# EAGLE design Multiplier (EAGLE 7.2.0)
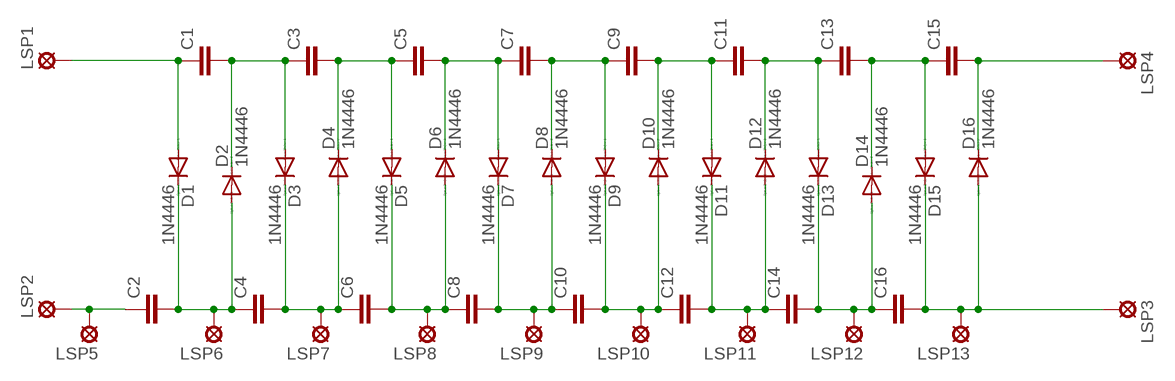
[diagram p0: schematic, sheet 1]

## Parts
C1  C5/4.5  [C5B4.5]
C2  C5/4.5  [C5B4.5]
C3  C5/4.5  [C5B4.5]
C4  C5/4.5  [C5B4.5]
C5  C5/4.5  [C5B4.5]
C6  C5/4.5  [C5B4.5]
C7  C5/4.5  [C5B4.5]
C8  C5/4.5  [C5B4.5]
C9  C5/4.5  [C5B4.5]
C10  C5/4.5  [C5B4.5]
C11  C5/4.5  [C5B4.5]
C12  C5/4.5  [C5B4.5]
C13  C5/4.5  [C5B4.5]
C14  C5/4.5  [C5B4.5]
C15  C5/4.5  [C5B4.5]
C16  C5/4.5  [C5B4.5]
D1  1N4446  [DO35-10]
D2  1N4446  [DO35-10]
D3  1N4446  [DO35-10]
D4  1N4446  [DO35-10]
D5  1N4446  [DO35-10]
D6  1N4446  [DO35-10]
D7  1N4446  [DO35-10]
D8  1N4446  [DO35-10]
D9  1N4446  [DO35-10]
D10  1N4446  [DO35-10]
D11  1N4446  [DO35-10]
D12  1N4446  [DO35-10]
D13  1N4446  [DO35-10]
D14  1N4446  [DO35-10]
D15  1N4446  [DO35-10]
D16  1N4446  [DO35-10]
LSP1  LSP10  [LSP10]
LSP2  LSP10  [LSP10]
LSP3  LSP10  [LSP10]
LSP4  LSP10  [LSP10]
LSP5  LSP10  [LSP10]
LSP6  LSP10  [LSP10]
LSP7  LSP10  [LSP10]
LSP8  LSP10  [LSP10]
LSP9  LSP10  [LSP10]
LSP10  LSP10  [LSP10]
LSP11  LSP10  [LSP10]
LSP12  LSP10  [LSP10]
LSP13  LSP10  [LSP10]

## Nets
N$1: C1.1 D1.A LSP1.MP
N$2: C2.1 LSP2.MP LSP5.MP
N$3: C2.2 C4.1 D1.C D2.A LSP6.MP
N$4: C4.2 C6.1 D3.C D4.A LSP7.MP
N$5: C6.2 C8.1 D5.C D6.A LSP8.MP
N$6: C8.2 C10.1 D7.C D8.A LSP9.MP
N$7: C10.2 C12.1 D9.C D10.A LSP10.MP
N$8: C12.2 C14.1 D11.C D12.A LSP11.MP
N$9: C14.2 C16.1 D13.C D14.A LSP12.MP
N$10: C16.2 D15.C D16.A LSP3.MP LSP13.MP
N$11: C1.2 C3.1 D2.C D3.A
N$12: C3.2 C5.1 D4.C D5.A
N$13: C5.2 C7.1 D6.C D7.A
N$14: C7.2 C9.1 D8.C D9.A
N$15: C9.2 C11.1 D10.C D11.A
N$16: C11.2 C13.1 D12.C D13.A
N$17: C13.2 C15.1 D14.C D15.A
N$18: C15.2 D16.C LSP4.MP

## Library data of the parts
C1-C16 = capacitor-wima:C: CAPACITOR naming: grid - package width
D1-D16 = diode:1N4446: DIODE high speed (Philips)
LSP1-LSP13 = solpad:LSP10: SOLDER PAD drill 1.0 mm, distributor Buerklin, 12H555

## Board
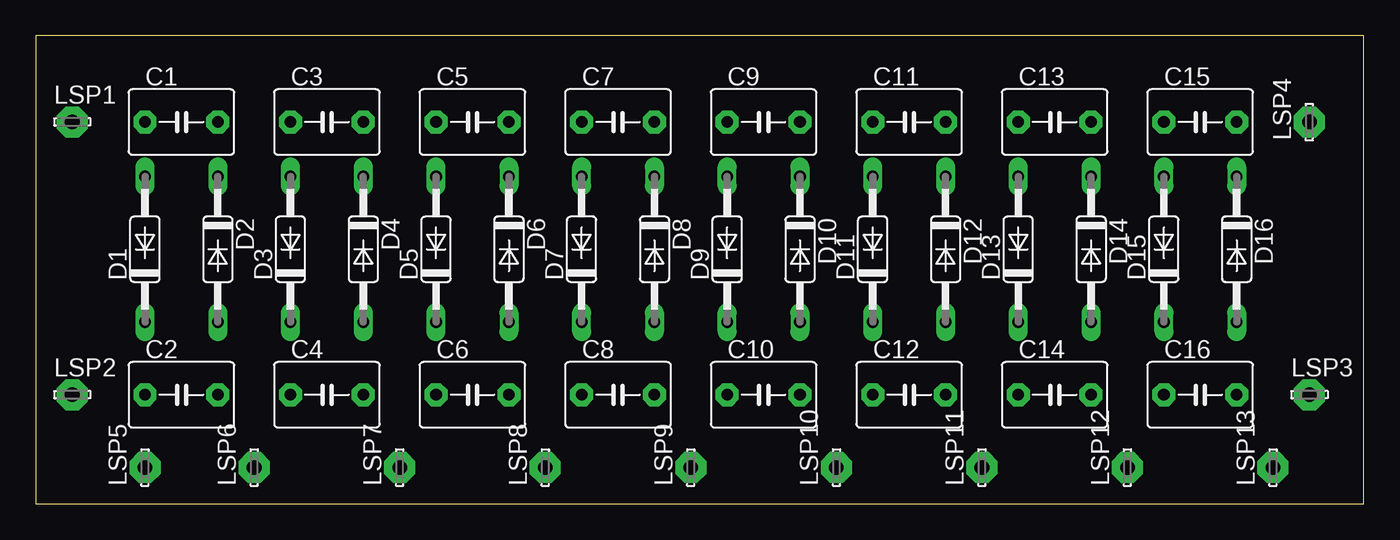
[diagram p1: board, top side]
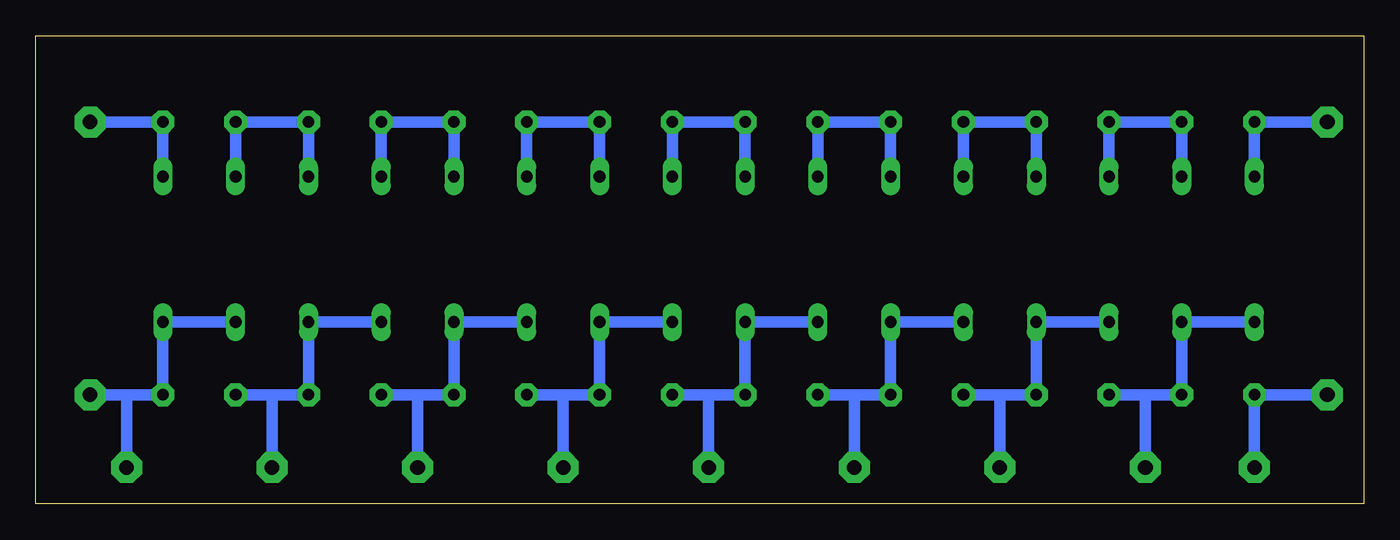
[diagram p2: board, bottom side, seen from below]

Size 92.69 x 32.69 mm. Coordinates in mm from the lower left corner, seen from the top.
Outline: 0,0 92.69,0 92.69,32.69 0,32.69 0,0
Copper layers (1*16): Top 0.035mm / dielectric 1.5mm / Bottom 0.035mm
Design rules "default": minimum track width 10mil, minimum drill 24mil, track to track 8mil, track to pad 8mil, pad to pad 8mil, via to via 8mil, smd to smd 8mil, copper to edge 40mil, drill to drill 8mil, minimum pad ring 10mil, minimum via ring 8mil, stop-mask expansion 4mil, vias tented up to drill 0mil, thermal gap 10mil

### Footprints (pad centres in the part's own frame; a part is rotated, then mirrored left to right if it is on the bottom)
C5B4.5 = drill 0.813 pad 1.6 octagon: 1 -2.54,0; 2 2.54,0
DO35-10 = drill 0.813 long: A 5.08,0; C -5.08,0
LSP10 = drill 1.016 pad 2.159 octagon: MP 0,0

### Placement (x,y rotation side)
C1  10.16,26.67 0 top
C2  10.16,7.62 0 top
C3  20.32,26.67 0 top
C4  20.32,7.62 0 top
C5  30.48,26.67 0 top
C6  30.48,7.62 0 top
C7  40.64,26.67 0 top
C8  40.64,7.62 0 top
C9  50.8,26.67 0 top
C10  50.8,7.62 0 top
C11  60.96,26.67 0 top
C12  60.96,7.62 0 top
C13  71.12,26.67 0 top
C14  71.12,7.62 0 top
C15  81.28,26.67 0 top
C16  81.28,7.62 0 top
D1  7.62,17.78 90 top
D2  12.7,17.78 270 top
D3  17.78,17.78 90 top
D4  22.86,17.78 270 top
D5  27.94,17.78 90 top
D6  33.02,17.78 270 top
D7  38.1,17.78 90 top
D8  43.18,17.78 270 top
D9  48.26,17.78 90 top
D10  53.34,17.78 270 top
D11  58.42,17.78 90 top
D12  63.5,17.78 270 top
D13  68.58,17.78 90 top
D14  73.66,17.78 270 top
D15  78.74,17.78 90 top
D16  83.82,17.78 270 top
LSP1  2.54,26.67 0 top
LSP2  2.54,7.62 0 top
LSP3  88.9,7.62 0 top
LSP4  88.9,26.67 90 top
LSP5  7.62,2.54 90 top
LSP6  15.24,2.54 90 top
LSP7  25.4,2.54 90 top
LSP8  35.56,2.54 90 top
LSP9  45.72,2.54 90 top
LSP10  55.88,2.54 90 top
LSP11  66.04,2.54 90 top
LSP12  76.2,2.54 90 top
LSP13  86.36,2.54 90 top

### Tracks (layer width: path | path; a pad name or v marks a point on that pad's centre or on a via)
N$1
  Bottom 0.813: LSP1.MP C1.1 D1.A
N$2
  Bottom 0.813: LSP2.MP C2.1 LSP5.MP
N$3
  Bottom 0.813: C4.1 15.24,7.62 | 15.24,7.62 C2.2 D2.A D1.C | LSP6.MP 15.24,7.62
N$4
  Bottom 0.813: C6.1 25.4,7.62 | 25.4,7.62 C4.2 D4.A D3.C | LSP7.MP 25.4,7.62
N$5
  Bottom 0.813: C8.1 35.56,7.62 | 35.56,7.62 C6.2 D6.A D5.C | LSP8.MP 35.56,7.62
N$6
  Bottom 0.813: C10.1 45.72,7.62 | 45.72,7.62 C8.2 D8.A D7.C | LSP9.MP 45.72,7.62
N$7
  Bottom 0.813: C12.1 55.88,7.62 | 55.88,7.62 C10.2 D10.A D9.C | LSP10.MP 55.88,7.62
N$8
  Bottom 0.813: C14.1 66.04,7.62 | 66.04,7.62 C12.2 D12.A D11.C | LSP11.MP 66.04,7.62
N$9
  Bottom 0.813: C16.1 76.2,7.62 | 76.2,7.62 C14.2 D14.A D13.C | LSP12.MP 76.2,7.62
N$10
  Bottom 0.813: LSP3.MP 86.36,7.62 | 86.36,7.62 C16.2 D16.A D15.C | LSP13.MP 86.36,7.62
N$11
  Bottom 0.813: D2.C C1.2 C3.1 D3.A
N$12
  Bottom 0.813: D4.C C3.2 C5.1 D5.A
N$13
  Bottom 0.813: D6.C C5.2 C7.1 D7.A
N$14
  Bottom 0.813: D8.C C7.2 C9.1 D9.A
N$15
  Bottom 0.813: D10.C C9.2 C11.1 D11.A
N$16
  Bottom 0.813: D12.C C11.2 C13.1 D13.A
N$17
  Bottom 0.813: D14.C C13.2 C15.1 D15.A
N$18
  Bottom 0.813: LSP4.MP C15.2 D16.C